# Altium schematic sheet CO2_Sensor_Unit_board.SchDoc
size A2
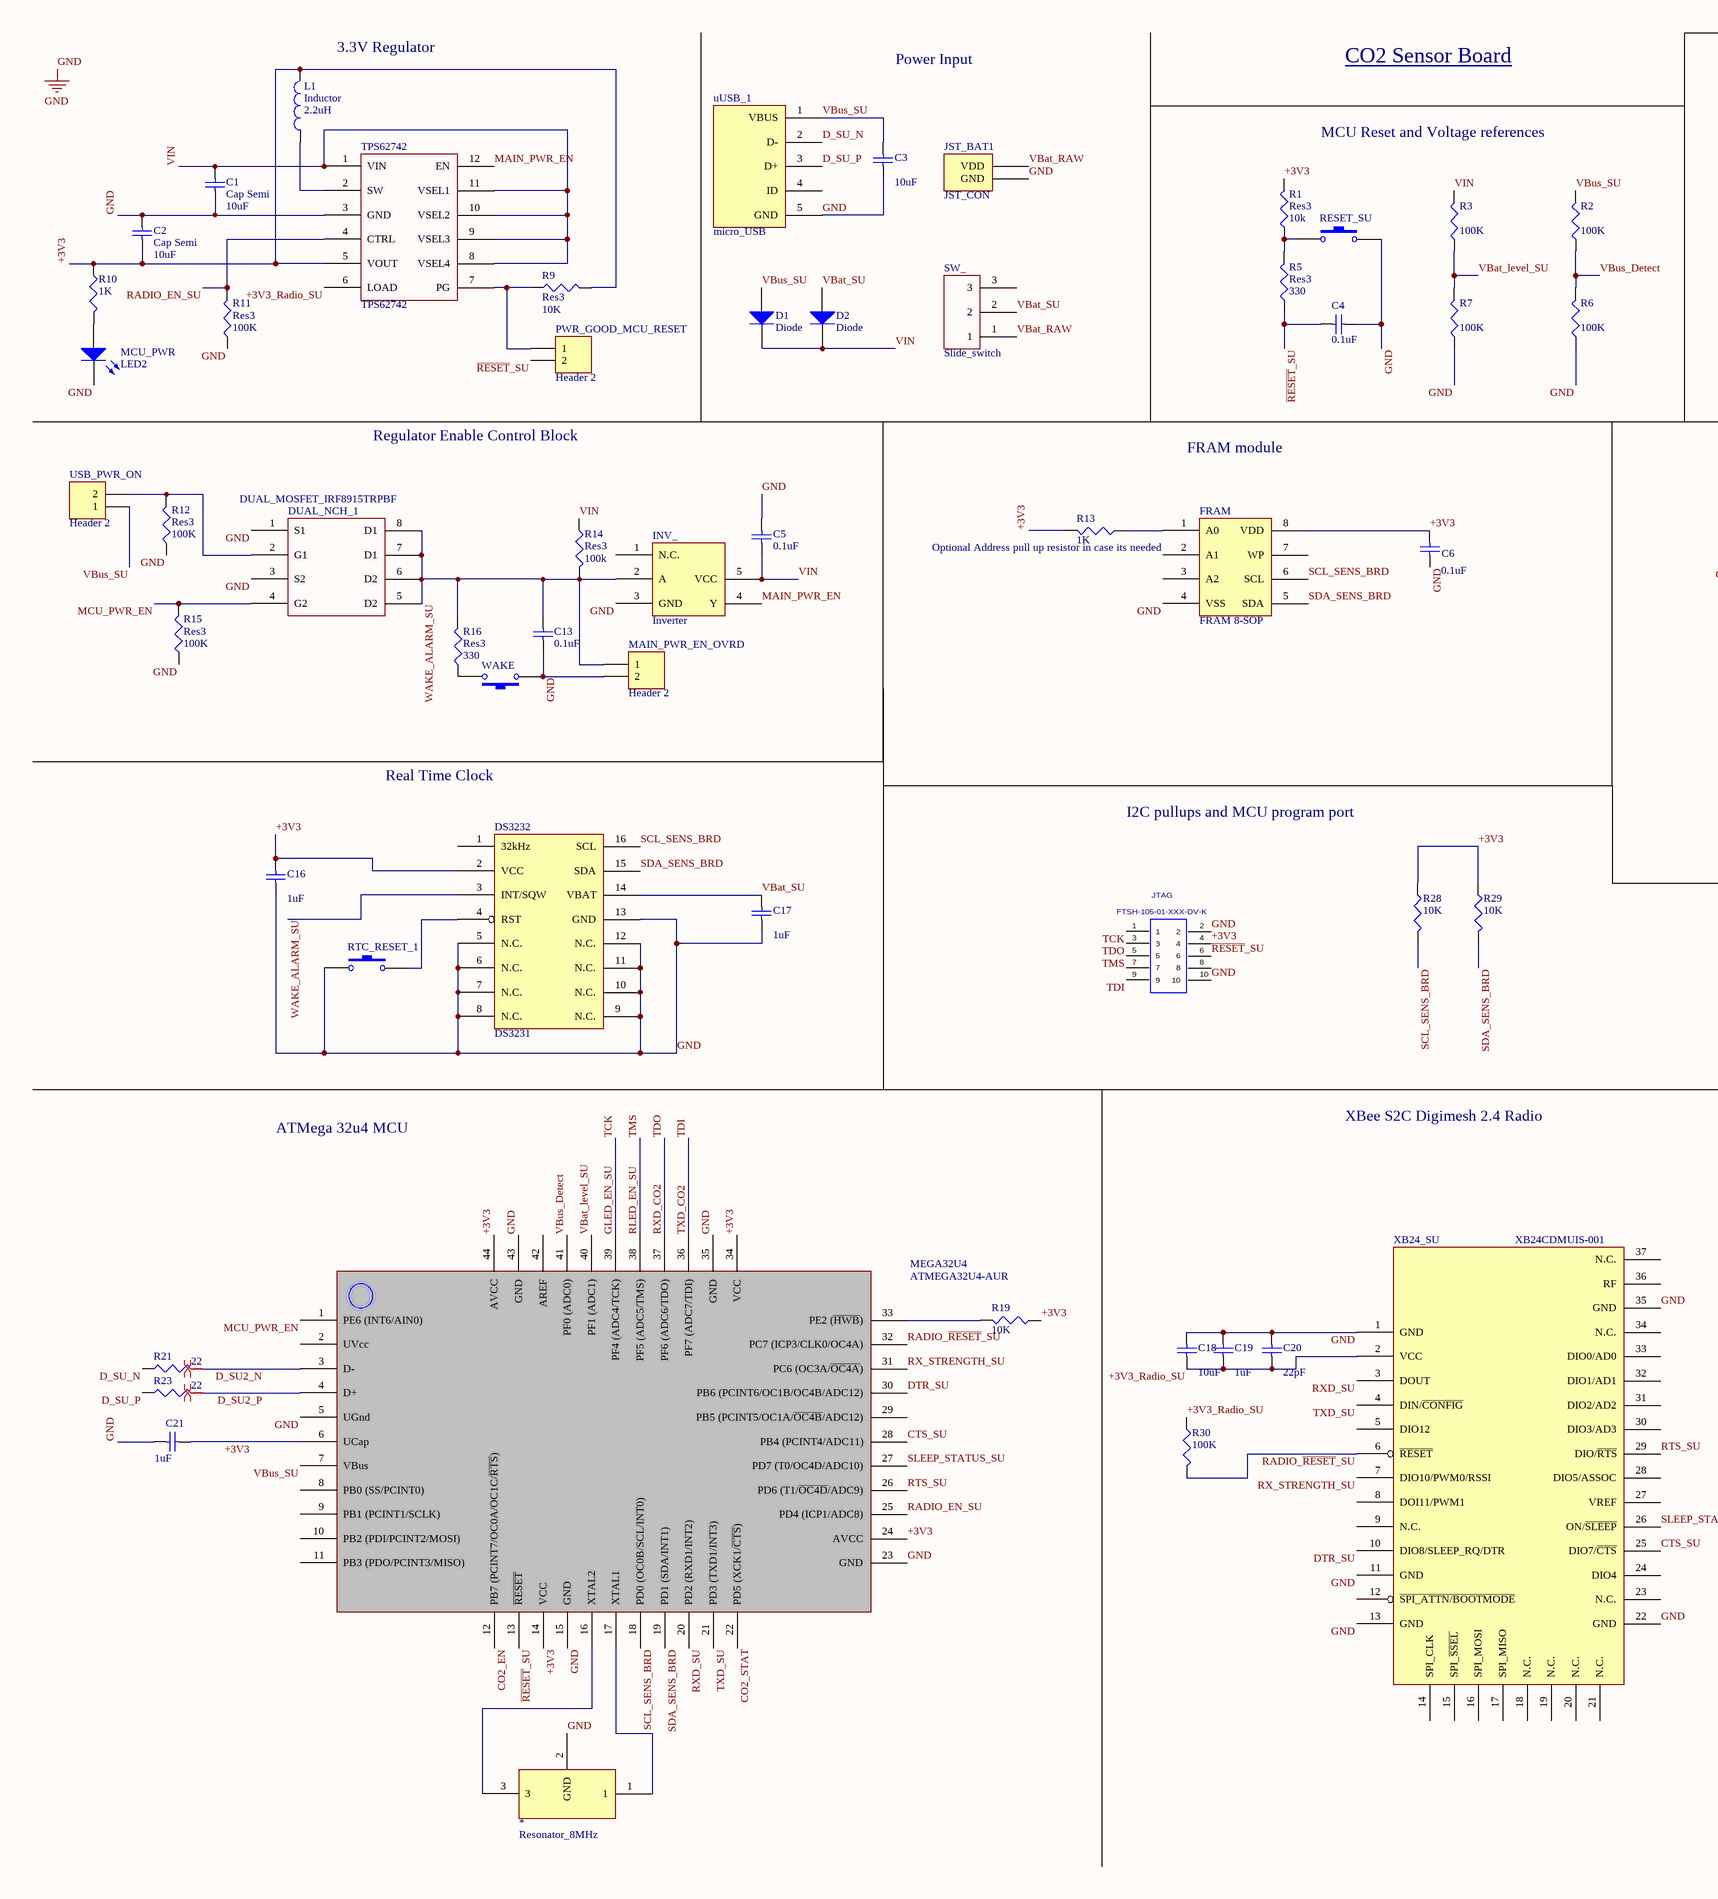
[diagram p0: CO2_Sensor_Unit_board.SchDoc, left]
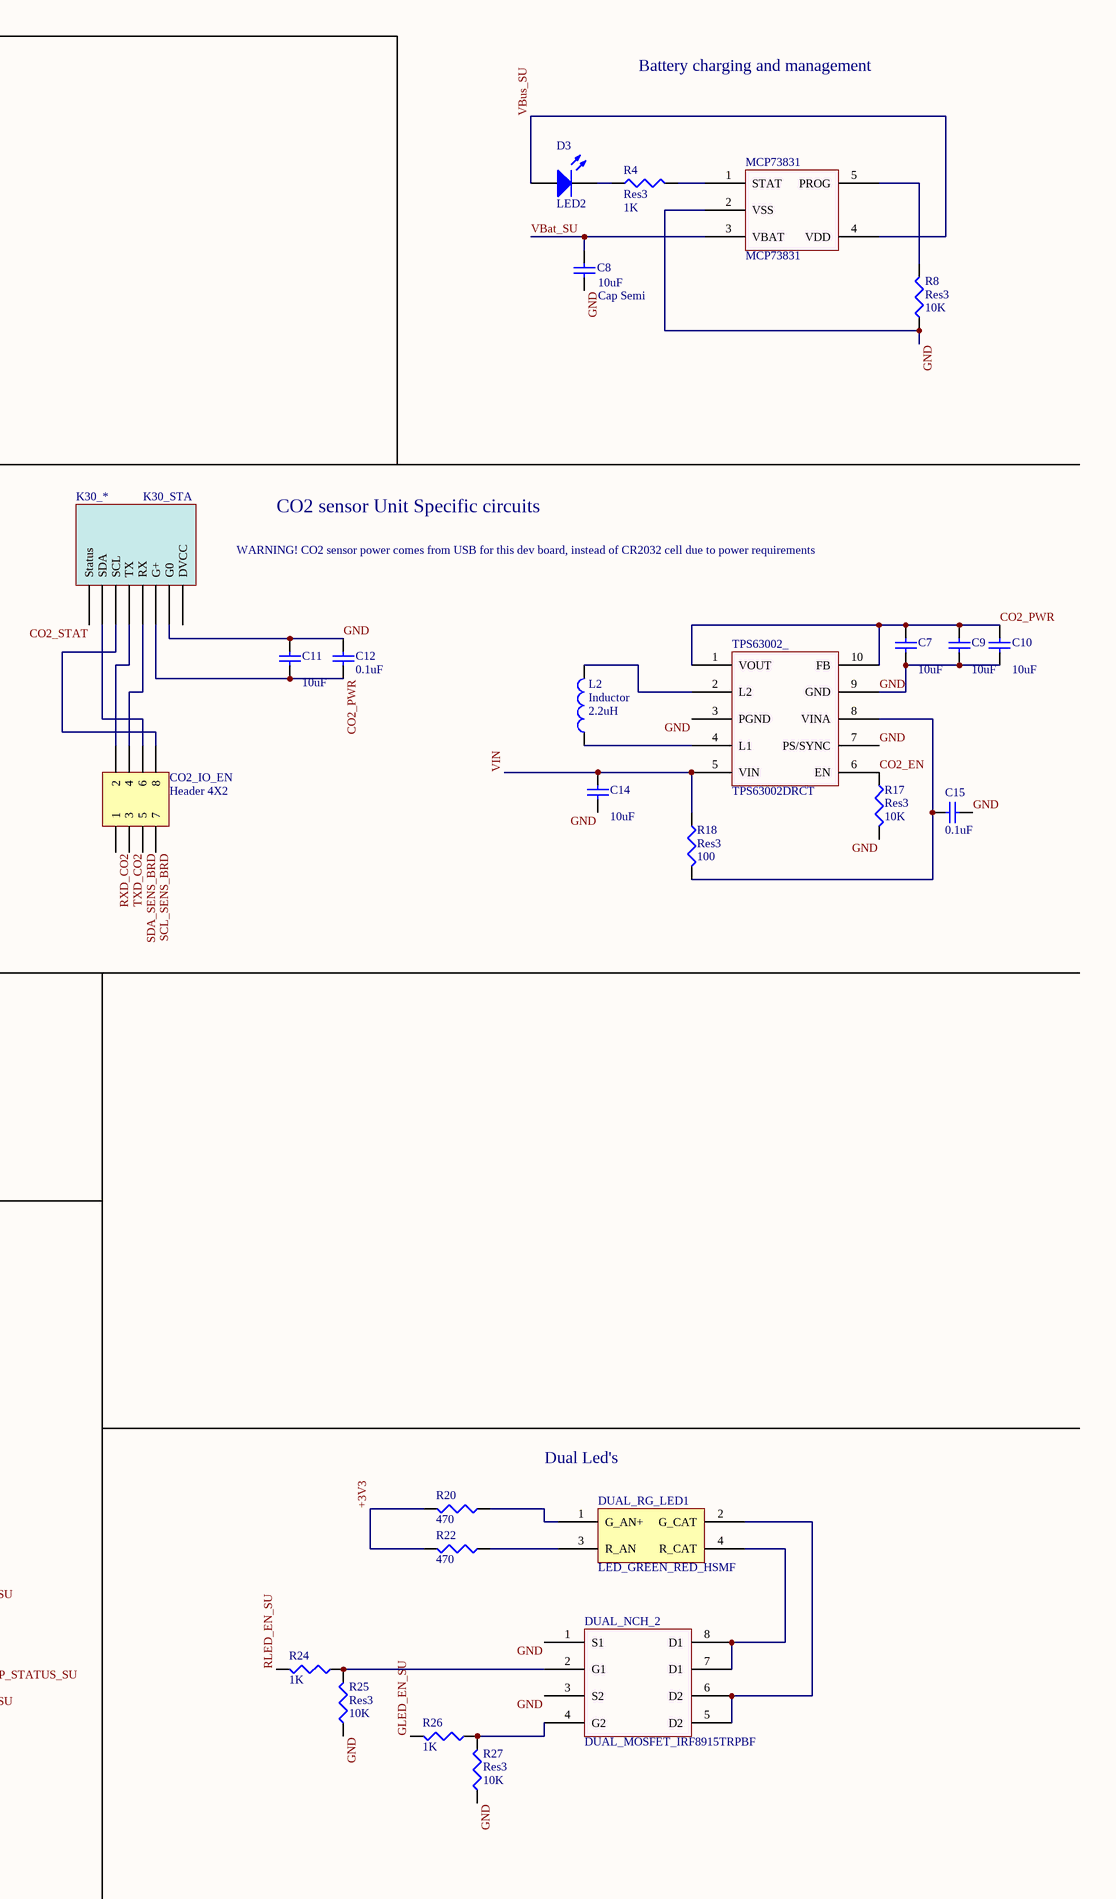
[diagram p1: CO2_Sensor_Unit_board.SchDoc, right]

## Parts
*  Resonator_8MHz  [Resonator_8MHz]
C1  Cap Semi  value 10uF  [1608[0603]]
C2  Cap Semi  value 10uF  [1608[0603]]
C3  value 10uF  [1608[0603]]  (hidden comment: Cap Semi)
C4  value 0.1uF  [C0805]  (hidden comment: Cap Semi)
C5  value 0.1uF  [C0805]  (hidden comment: Cap Semi)
C6  value 0.1uF  [C0805]  (hidden comment: Cap Semi)
C7  value 10uF  [1608[0603]]  (hidden comment: Cap Semi)
C8  Cap Semi  value 10uF  [1608[0603]]
C9  value 10uF  [1608[0603]]  (hidden comment: Cap Semi)
C10  value 10uF  [1608[0603]]  (hidden comment: Cap Semi)
C11  value 10uF  [1608[0603]]  (hidden comment: Cap Semi)
C12  value 0.1uF  [C0805]  (hidden comment: Cap Semi)
C13  value 0.1uF  [C0805]  (hidden comment: Cap Semi)
C14  value 10uF  [1608[0603]]  (hidden comment: Cap Semi)
C15  value 0.1uF  [C0805]  (hidden comment: Cap Semi)
C16  value 1uF  [C0805]  (hidden comment: Cap Semi)
C17  value 1uF  [C0805]  (hidden comment: Cap Semi)
C18  value 10uF  [1608[0603]]  (hidden comment: Cap Semi)
C19  value 1uF  [C0805]  (hidden comment: Cap Semi)
C20  value 22pF  [1608[0603]]  (hidden comment: Cap Semi)
C21  value 1uF  [C0805]  (hidden comment: Cap Semi)
CO2_IO_EN  Header 4X2  [HDR2X4]
D1  Diode  [DO-214AC]
D2  Diode  [DO-214AC]
D3  LED2  [LED_Single_Orange]
DS3232  DS3231  [16 SO]
DUAL_NCH_1  DUAL_MOSFET_IRF8915TRPBF  [SOP-8]
DUAL_NCH_2  DUAL_MOSFET_IRF8915TRPBF  [SOP-8]
DUAL_RG_LED1  LED_GREEN_RED_HSMF  [LED4]
FRAM  FRAM 8-SOP  [SOP-8]
INV_  Inverter  [SOT-23]
JST_BAT1  JST_CON  [JST_CONN_SMT_Vertical]
JTAG  FTSH-105-01-XXX-DV-K  [FTSH-105-01-XXX-DV-K]
K30_*  K30_STA  [K30_STA]
L1  Inductor  value 2.2uH  [2.2uH_Inductor]
L2  Inductor  value 2.2uH  [2.2uH_Inductor]
MAIN_PWR_EN_OVRD  Header 2  [HDR1X2]
MCP73831  MCP73831  [SOT-23]
MCU_PWR  LED2  [LED_Single_Orange]
MEGA32U4  ATMEGA32U4-AUR  [Quad44]
PWR_GOOD_MCU_RESET  Header 2  [SMD_Jumper]
R1  Res3  value 10k  [6-0805_N]
R2  value 100K  [6-0805_N]  (hidden comment: Res3)
R3  value 100K  [6-0805_N]  (hidden comment: Res3)
R4  Res3  value 1K  [6-0805_N]
R5  Res3  value 330  [6-0805_N]
R6  value 100K  [6-0805_N]  (hidden comment: Res3)
R7  value 100K  [6-0805_N]  (hidden comment: Res3)
R8  Res3  value 10K  [6-0805_N]
R9  Res3  value 10K  [6-0805_N]
R10  value 1K  [6-0805_N]  (hidden comment: Res3)
R11  Res3  value 100K  [6-0805_N]
R12  Res3  value 100K  [6-0805_N]
R13  value 1K  [6-0805_N]  (hidden comment: Res3)
R14  Res3  value 100k  [6-0805_N]
R15  Res3  value 100K  [6-0805_N]
R16  Res3  value 330  [6-0805_N]
R17  Res3  value 10K  [6-0805_N]
R18  Res3  value 100  [6-0805_N]
R19  value 10K  [6-0805_N]  (hidden comment: Res3)
R20  value 470  [6-0805_N]  (hidden comment: Res3)
R21  value 22  [6-0805_N]  (hidden comment: Res3)
R22  value 470  [6-0805_N]  (hidden comment: Res3)
R23  value 22  [6-0805_N]  (hidden comment: Res3)
R24  value 1K  [6-0805_N]  (hidden comment: Res3)
R25  Res3  value 10K  [6-0805_N]
R26  value 1K  [6-0805_N]  (hidden comment: Res3)
R27  Res3  value 10K  [6-0805_N]
R28  value 10K  [6-0805_N]  (hidden comment: Res3)
R29  value 10K  [6-0805_N]  (hidden comment: Res3)
R30  value 100K  [6-0805_N]  (hidden comment: Res3)
RESET_SU  SW-PB  [SW_TACTILE]  (value not drawn)
RTC_RESET_1  SW-PB  [SW_TACTILE]  (value not drawn)
SW_  Slide_switch  [Slide_SW]
TPS62742  TPS62742  [WSON12 - small]
TPS63002_  TPS63002DRCT  [SON10 - small]
USB_PWR_ON  Header 2  [HDR1X2]
uUSB_1  micro_USB  [MicroUSB_CONN]
WAKE  SW-PB  [SW_TACTILE]  (value not drawn)
XB24_SU  XB24CDMUIS-001  [XB24_RADIO]

## Nets
GND: *.2(GND) C1.1 C2.1 C3.1 C4.1 C5.1 C6.1 C7.2 C8.1 C9.2 C10.2 C11.2 C12.2 C13.2 C14.1 C15.2 C16.1 C17.1 C18.2 C19.2 C20.2 C21.1 DS3232.5(N.C.) DS3232.6(N.C.) DS3232.7(N.C.) DS3232.8(N.C.) DS3232.9(N.C.) DS3232.10(N.C.) DS3232.11(N.C.) DS3232.12(N.C.) DS3232.13(GND) DUAL_NCH_1.1(S1) DUAL_NCH_1.3(S2) DUAL_NCH_2.1(S1) DUAL_NCH_2.3(S2) FRAM.4(VSS) INV_.3(GND) JST_BAT1.1(GND) JTAG.2 JTAG.10 K30_*.7(G0) MAIN_PWR_EN_OVRD.2 MCP73831.2(VSS) MCU_PWR.2(K) MEGA32U4.5(UGnd) MEGA32U4.15(GND) MEGA32U4.23(GND) MEGA32U4.35(GND) MEGA32U4.43(GND) R6.1 R7.1 R8.1 R11.1 R12.1 R15.1 R17.2 R25.1 R27.1 RESET_SU.2 RTC_RESET_1.1 TPS62742.3(GND) TPS63002_.3(PGND) TPS63002_.7(PS/SYNC) TPS63002_.9(GND) uUSB_1.5(GND) WAKE.1 XB24_SU.1(GND) XB24_SU.11(GND) XB24_SU.13(GND) XB24_SU.22(GND) XB24_SU.35(GND)
+3V3: C2.2 C6.2 C16.2 C21.2 DS3232.2(VCC) FRAM.8(VDD) JTAG.4 L1.2 MEGA32U4.6(UCap) MEGA32U4.14(VCC) MEGA32U4.24(AVCC) MEGA32U4.34(VCC) MEGA32U4.44(AVCC) R1.2 R9.2 R10.1 R13.2 R19.1 R20.2 R22.2 R28.1 R29.1 TPS62742.5(VOUT)
+3V3_Radio_SU: C18.1 C19.1 C20.1 R30.1 TPS62742.6(LOAD) XB24_SU.2(VCC)
CO2_EN: MEGA32U4.12(PB7_(PCINT7/OC0A/OC1C/~{RTS})) R17.1 TPS63002_.6(EN)
CO2_PWR: C7.1 C9.1 C10.1 C11.1 C12.1 K30_*.6(G+) TPS63002_.1(VOUT) TPS63002_.10(FB)
CO2_STAT: K30_*.1(Status) MEGA32U4.22(PD5_(XCK1/~{CTS}))
CTS_SU: MEGA32U4.28(PB4_(PCINT4/ADC11)) XB24_SU.25(DIO7/~{CTS})
D_SU2_N: MEGA32U4.3(D-) R21.2
D_SU2_P: MEGA32U4.4(D+) R23.2
D_SU_N: R21.1 uUSB_1.2(D-)
D_SU_P: R23.1 uUSB_1.3(D+)
DTR_SU: MEGA32U4.30(PB6_(PCINT6/OC1B/OC4B/ADC12)) XB24_SU.10(DIO8/SLEEP_RQ/DTR)
GLED_EN_SU: JTAG.1 MEGA32U4.39(PF4_(ADC4/TCK)) R26.2  [also labelled TCK]
MAIN_PWR_EN: INV_.4(Y) TPS62742.12(EN)
MCU_PWR_EN: DUAL_NCH_1.4(G2) MEGA32U4.1(PE6_(INT6/AIN0)) R15.2
~{RESET}_SU: C4.2 JTAG.6 MEGA32U4.13(~{RESET}) PWR_GOOD_MCU_RESET.2 R5.1
RADIO_EN_SU: MEGA32U4.25(PD4_(ICP1/ADC8)) R11.2 TPS62742.4(CTRL)
RADIO_~{RESET}_SU: MEGA32U4.32(PC7_(ICP3/CLK0/OC4A)) R30.2 XB24_SU.6(~{RESET})
RLED_EN_SU: JTAG.5 MEGA32U4.38(PF5_(ADC5/TMS)) R24.2  [also labelled TMS]
RTS_SU: MEGA32U4.26(PD6_(T1/~{OC4D}/ADC9)) XB24_SU.29(DIO/~{RTS})
RX_STRENGTH_SU: MEGA32U4.31(PC6_(OC3A/~{OC4A})) XB24_SU.7(DIO10/PWM0/RSSI)
RXD_CO2: CO2_IO_EN.1 JTAG.3 MEGA32U4.37(PF6_(ADC6/TDO))  [also labelled TDO]
RXD_SU: MEGA32U4.20(PD2_(RXD1/INT2)) XB24_SU.3(DOUT)
SCL_SENS_BRD: CO2_IO_EN.7 DS3232.16(SCL) FRAM.6(SCL) MEGA32U4.18(PD0_(OC0B/SCL/INT0)) R28.2
SDA_SENS_BRD: CO2_IO_EN.5 DS3232.15(SDA) FRAM.5(SDA) MEGA32U4.19(PD1_(SDA/INT1)) R29.2
SLEEP_STATUS_SU: MEGA32U4.27(PD7_(T0/OC4D/ADC10)) XB24_SU.26(ON/~{SLEEP})
TDI: CO2_IO_EN.3 JTAG.9 MEGA32U4.36(PF7_(ADC7/TDI))  [also labelled TXD_CO2]
TXD_SU: MEGA32U4.21(PD3_(TXD1/INT3)) XB24_SU.4(DIN/~{CONFIG})
VBat_level_SU: MEGA32U4.40(PF1_(ADC1)) R3.1 R7.2
VBat_RAW: JST_BAT1.2(VDD) SW_.1
VBat_SU: C8.2 C17.2 D2.1(A) DS3232.14(VBAT) MCP73831.3(VBAT) SW_.2
VBus_Detect: MEGA32U4.41(PF0_(ADC0)) R2.1 R6.2
VBus_SU: C3.2 D1.1(A) D3.1(A) MCP73831.4(VDD) MEGA32U4.7(VBus) R2.2 USB_PWR_ON.1 uUSB_1.1(VBUS)
VIN: C1.2 C5.2 C14.2 D1.2(K) D2.2(K) INV_.5(VCC) R3.2 R14.1 R18.1 TPS62742.1(VIN) TPS62742.8(VSEL4) TPS62742.9(VSEL3) TPS62742.10(VSEL2) TPS62742.11(VSEL1) TPS63002_.5(VIN)
WAKE_ALARM_SU: C13.1 DS3232.3(INT/SQW) DUAL_NCH_1.5(D2) DUAL_NCH_1.6(D2) DUAL_NCH_1.7(D1) DUAL_NCH_1.8(D1) INV_.2(A) MAIN_PWR_EN_OVRD.1 R14.2 R16.2
Net*_1: *.1 MEGA32U4.17(XTAL1)
Net*_3: *.3 MEGA32U4.16(XTAL2)
NetC15_1: C15.1 R18.2 TPS63002_.8(VINA)
NetCO2_IO_EN_2: CO2_IO_EN.2 K30_*.4(TX)
NetCO2_IO_EN_4: CO2_IO_EN.4 K30_*.5(RX)
NetCO2_IO_EN_6: CO2_IO_EN.6 K30_*.2(SDA)
NetCO2_IO_EN_8: CO2_IO_EN.8 K30_*.3(SCL)
NetD3_2: D3.2(K) R4.1
NetDS3232_4: DS3232.4(RST) RTC_RESET_1.2
NetDUAL_NCH_1_2: DUAL_NCH_1.2(G1) R12.2 USB_PWR_ON.2
NetDUAL_NCH_2_2: DUAL_NCH_2.2(G1) R24.1 R25.2
NetDUAL_NCH_2_4: DUAL_NCH_2.4(G2) R26.1 R27.2
NetDUAL_NCH_2_5: DUAL_NCH_2.5(D2) DUAL_NCH_2.6(D2) DUAL_RG_LED1.2(G_CAT)
NetDUAL_NCH_2_7: DUAL_NCH_2.7(D1) DUAL_NCH_2.8(D1) DUAL_RG_LED1.4(R_CAT)
NetDUAL_RG_LED1_1: DUAL_RG_LED1.1(G_AN+) R20.1
NetDUAL_RG_LED1_3: DUAL_RG_LED1.3(R_AN) R22.1
NetFRAM_1: FRAM.1(A0) R13.1
NetL1_1: L1.1 TPS62742.2(SW)
NetL2_1: L2.1 TPS63002_.4(L1)
NetL2_2: L2.2 TPS63002_.2(L2)
NetMCP73831_1: MCP73831.1(STAT) R4.2
NetMCP73831_5: MCP73831.5(PROG) R8.2
NetMCU_PWR_1: MCU_PWR.1(A) R10.2
NetMEGA32U4_33: MEGA32U4.33(PE2_(~{HWB})) R19.2
NetPWR_GOOD_MCU_RESET_1: PWR_GOOD_MCU_RESET.1 R9.1 TPS62742.7(PG)
NetR1_1: R1.1 R5.2 RESET_SU.1
NetR16_1: R16.1 WAKE.2

Not connected (* = marked no-connect by the designer): DS3232 1(32kHz); FRAM 2(A1) 3(A2) 7(WP); INV_ 1(N.C.); JTAG 7 8; K30_* 8(DVCC); MEGA32U4 2(UVcc) 8(PB0_(SS/PCINT0)) 9(PB1_(PCINT1/SCLK)) 10(PB2_(PDI/PCINT2/MOSI)) 11(PB3_(PDO/PCINT3/MISO)) 29(PB5_(PCINT5/OC1A/~{OC4B}/ADC12)) 42(AREF); SW_ 3; uUSB_1 4(ID); XB24_SU 5(DIO12) 8(DOI11/PWM1) 9(N.C.) 12(~{SPI_ATTN/BOOTMODE}) 14(SPI_CLK) 15(SPI_~{SSEL}) 16(SPI_MOSI) 17(SPI_MISO) 18(N.C.) 19(N.C.) 20(N.C.) 21(N.C.) 23(N.C.) 24(DIO4) 27(VREF) 28(DIO5/ASSOC) 30(DIO3/AD3) 31(DIO2/AD2) 32(DIO1/AD1) 33(DIO0/AD0) 34(N.C.) 36(RF) 37(N.C.)

## Layout directives
differential pair: D_SU2_N, D_SU2_P

## Notes on the sheet
- (near L1) 3.3V Regulator
- Power Input
- CO2 Sensor Board
- Battery charging and management
- MCU Reset and Voltage references
- Regulator Enable Control Block
- FRAM module
- CO2 sensor Unit Specific circuits
- WARNING! CO2 sensor power comes from USB for this dev board, instead of CR2032 cell due to power requirements
- (near FRAM) Optional Address pull up resistor in case its needed
- Real Time Clock
- I2C pullups and MCU program port
- ATMega 32u4 MCU
- XBee S2C Digimesh 2.4 Radio
- Dual Led's

## Library data of the parts
C1-C21 = Cap Semi: Capacitor (Semiconductor SIM Model); Published: 8-Jun-2000; LatestRevisionDate: 29-May-2009; LatestRevisionNote: IPC-7351 Footprint Added.; PackageReference: C1206; Publisher: Altium Limited; PackageDescription: Chip Capacitor
CO2_IO_EN = Header 4X2: Header, 4-Pin, Dual row; LatestRevisionDate: 17-Jul-2002; LatestRevisionNote: Re-released for DXP Platform.; Publisher: Altium Limited
D1 D2 = Diode: Default Diode; Published: 8-Jun-2000; LatestRevisionDate: 17-Jul-2002; LatestRevisionNote: Re-released for DXP Platform.; PackageVersion: Sep-1996; PackageReference: SMC; Publisher: Altium Limited; PackageDescription: DO-214-AB/SMC; 2 C-Bend Leads; Body 7.9 x 5.9 mm, inc. leads (LxW); Code_JEDEC: DO-214-AB
D3 MCU_PWR = LED2: Typical RED, GREEN, YELLOW, AMBER GaAs LED; Published: 8-Jun-2000; LatestRevisionDate: 17-Jul-2002; LatestRevisionNote: Re-released for DXP Platform.; PackageVersion: Feb-2002; PackageReference: 3.2X1.6X1.1; Publisher: Altium Limited; PackageDescription: SM LED; 2 Flat Leads
INV_ = SN74LVC1GU04
JTAG = FTSH-105-01-XXX-DV-K: TERMINAL STRIP, .050"(1.27mm) PITCH, 10 PINS, KEYED; MANUFACTURER: SAMTEC; CREATED: November 30, 2016 - Wendy Xin; PCB DECAL: FTSH-105-01-XXX-DV-K
L1 L2 = Inductor: Code_IEC: 1005; Published: 8-Jun-2000; LatestRevisionDate: 29-May-2009; LatestRevisionNote: IPC-7351 Footprint Added.; PackageReference: 0402-A; Publisher: Altium Limited; PackageDescription: Chip Inductor; Code_JEITA: 0402
MAIN_PWR_EN_OVRD PWR_GOOD_MCU_RESET USB_PWR_ON = Header 2: Header, 2-Pin; LatestRevisionDate: 17-Jul-2002; LatestRevisionNote: Re-released for DXP Platform.; Publisher: Altium Limited
R1-R30 = Res3: Resistor; Published: 8-Jun-2000; LatestRevisionDate: 29-May-2009; LatestRevisionNote: IPC-7351 Footprint Added.; PackageReference: J1-0603; Publisher: Altium Limited; PackageDescription: Chip Resistor
RESET_SU RTC_RESET_1 WAKE = SW-PB: Switch; Published: 24-Mar-1999; LatestRevisionDate: 17-Jul-2002; LatestRevisionNote: Re-released for DXP Platform.; PackageReference: SPST-2; Publisher: Altium Limited; PackageDescription: Switch; 2 Leads
TPS63002_ = TPS63001DRCT